# Altium schematic sheet mcu.SchDoc
size 279 x 215 mm
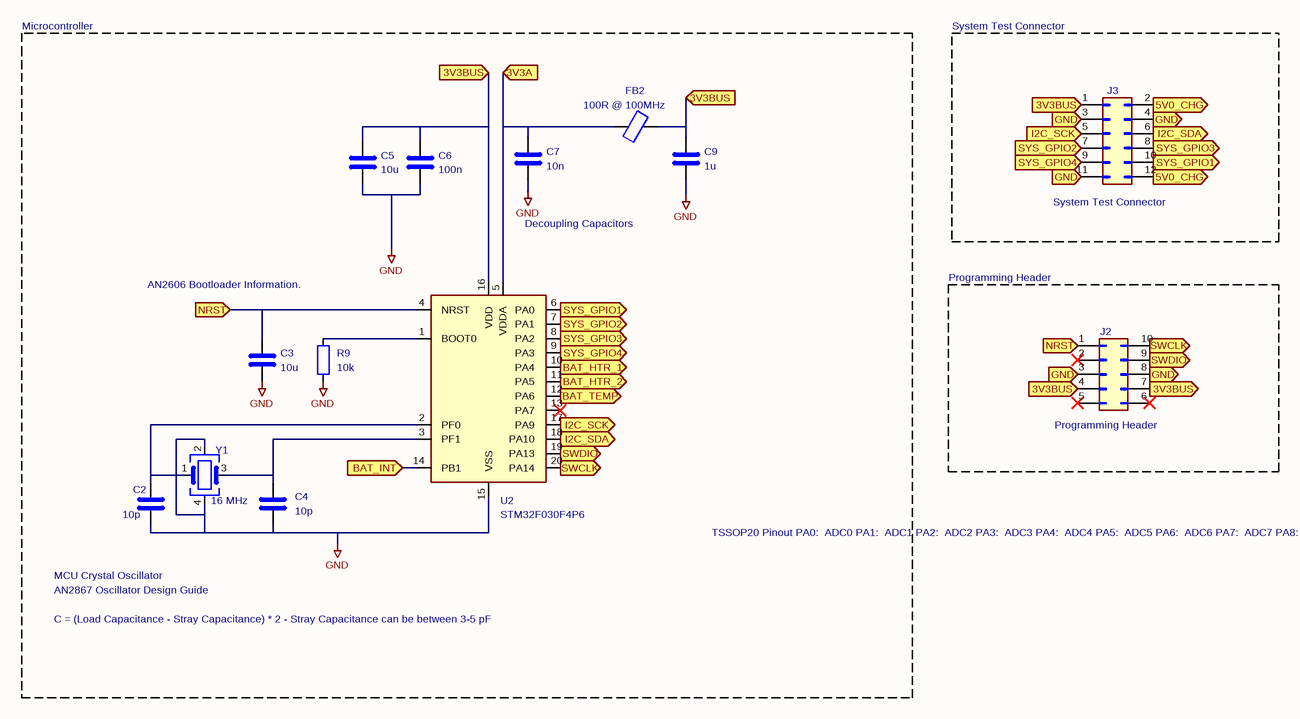
[diagram p0: mcu.SchDoc]

## Parts
C2  10p  [C_0402_1005Metric]
C3  10u  [C_0402_1005Metric]
C4  10p  [C_0402_1005Metric]
C5  10u  [C_0402_1005Metric]
C6  100n  [C_0402_1005Metric]
C7  10n  [C_0402_1005Metric]
C9  1u  [C_0402_1005Metric]
FB2  100R @ 100MHz  [L_0402_1005Metric]
J2  Programming Header  [PinSocket_2x05_P2.54mm_Vertical]
J3  System Test Connector  [PinSocket_2x06_P2.54mm_Vertical]
R9  10k  [R_0402_1005Metric]
U2  STM32F030F4P6  [TSSOP-20_4.4x6.5mm_P0.65mm]
Y1  16 MHz  [Crystal_SMD_3225-4Pin_3.2x2.5mm]

## Blocks framed on the sheet
Programming Header: J2

## Ports
3V3A (in), 3V3BUS (in), 5V0_CHG (in), BAT_HTR_1 (in), BAT_HTR_2 (in), BAT_INT (in), BAT_TEMP (in), GND (in), I2C_SCK (in), I2C_SDA (in), NRST (in), SWCLK (in), SWDIO (in), SYS_GPIO1 (in), SYS_GPIO2 (in), SYS_GPIO3 (in), SYS_GPIO4 (in)

## Nets
GND: C2.2 C3.2 C4.2 C5.2 C6.2 C7.2 C9.2 R9.2 U2.15(VSS) Y1.2 Y1.4
3V3A: C7.1 FB2.1 U2.5(VDDA) ; port 3V3A
3V3BUS: C5.1 C6.1 C9.1 FB2.2 J2.4(Pin_4) J2.7(Pin_7) J3.1(Pin_1) U2.16(VDD) ; port 3V3BUS
5V0_CHG: J3.2(Pin_2) J3.12(Pin_12) ; port 5V0_CHG
BAT_HTR_1: U2.10(PA4) ; port BAT_HTR_1
BAT_HTR_2: U2.11(PA5) ; port BAT_HTR_2
BAT_INT: U2.14(PB1) ; port BAT_INT
BAT_TEMP: U2.12(PA6) ; port BAT_TEMP
GND: J2.3(Pin_3) J2.8(Pin_8) J3.3(Pin_3) J3.4(Pin_4) J3.11(Pin_11) ; port GND  [a separate net that carries the same name]
I2C_SCK: J3.5(Pin_5) U2.17(PA9) ; port I2C_SCK
I2C_SDA: J3.6(Pin_6) U2.18(PA10) ; port I2C_SDA
NRST: C3.1 J2.1(Pin_1) U2.4(NRST) ; port NRST
SWCLK: J2.10(Pin_10) U2.20(PA14) ; port SWCLK
SWDIO: J2.9(Pin_9) U2.19(PA13) ; port SWDIO
SYS_GPIO1: J3.10(Pin_10) U2.6(PA0) ; port SYS_GPIO1
SYS_GPIO2: J3.7(Pin_7) U2.7(PA1) ; port SYS_GPIO2
SYS_GPIO3: J3.8(Pin_8) U2.8(PA2) ; port SYS_GPIO3
SYS_GPIO4: J3.9(Pin_9) U2.9(PA3) ; port SYS_GPIO4
NetC2_1: C2.1 U2.2(PF0) Y1.1
NetC4_1: C4.1 U2.3(PF1) Y1.3
NetR9_1: R9.1 U2.1(BOOT0)

Not connected (* = marked no-connect by the designer): J2 2(Pin_2)* 5(Pin_5)* 6(Pin_6)*; U2 13(PA7)*

## Notes on the sheet
- Microcontroller
- System Test Connector
- Decoupling Capacitors
- AN2606 Bootloader Information.
- AN2867 Oscillator Design Guide
- MCU Crystal Oscillator
- TSSOP20 Pinout
  PA0:  ADC0
  PA1:  ADC1
  PA2:  ADC2
  PA3:  ADC3
  PA4:  ADC4
  PA5:  ADC5
  PA6:  ADC6
  PA7:  ADC7
  PA8:  Not Available
  PA9:  I2C_SCL / I2C_SCK?
  PA10: I2C_SDA
  PA11:
  PA12:
  PA13: SWDIO
  PA14: SWCLK
- C = (Load Capacitance - Stray Capacitance) * 2
  - Stray Capacitance can be between 3-5 pF
- 1
- 2
- 3
- 4
- 5
- A
- B
- C
- D
- Title:
- File: mcu.kicad_sch
- Sheet: /
- KiCad E.D.A.  kicad (5.1.4)-1
- Size: USLetter
- Date:
- Rev:
- Id: 1/1

## Library data of the parts
C2-C7 C9 = C: Footprint: Capacitor_SMD:C_0402_1005Metric
  C2 C4: Value: 10p
  C3 C5: Value: 10u
  C6: Value: 100n
  C7: Value: 10n
  C9: Value: 1u
FB2 = FerriteBead: Value: 100R @ 100MHz; Footprint: Inductor_SMD:L_0402_1005Metric
J2 = Conn_02x05_Counter_Clockwise: Value: Programming Header; Footprint: Connector_PinSocket_2.54mm:PinSocket_2x05_P2.54mm_Vertical
J3 = Conn_02x06_Odd_Even: Value: System Test Connector; Footprint: Connector_PinSocket_2.54mm:PinSocket_2x06_P2.54mm_Vertical
R9 = R: Value: 10k; Footprint: Resistor_SMD:R_0402_1005Metric
U2 = STM32F030F4Px: Value: STM32F030F4P6; Footprint: Package_SO:TSSOP-20_4.4x6.5mm_P0.65mm
Y1 = Crystal_GND24: Value: 16 MHz; Footprint: Crystal:Crystal_SMD_3225-4Pin_3.2x2.5mm